# EAGLE schematic sirin-clone-schematic (EAGLE 9.3.1)
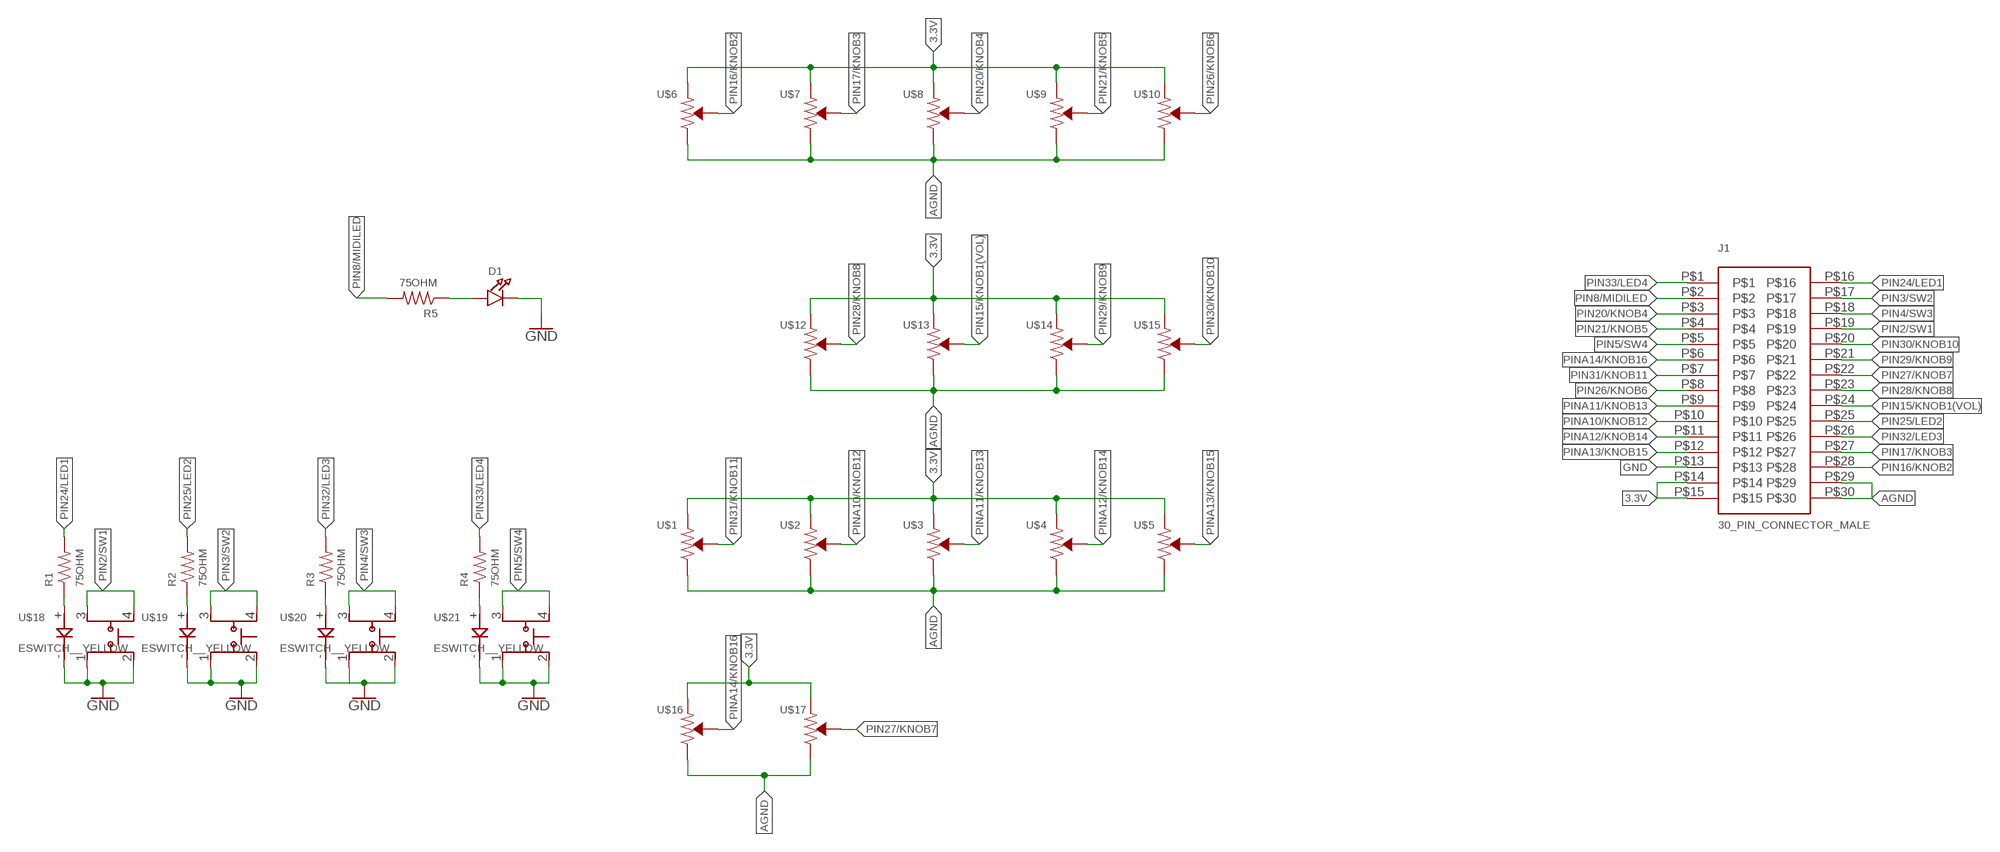
[diagram p0: schematic, sheet 1]

## Parts
D1  LED_RED0805  [CHIPLED_0805]
J1  30_PIN_CONNECTOR_MALE  [MOLEX_30PINCONNECTOR_2MM]
R1  75OHM  [0805]
R2  75OHM  [0805]
R3  75OHM  [0805]
R4  75OHM  [0805]
R5  75OHM  [0805]
U$1  BOURNS_10K_POTENTIOMETER  [BOURNS_PTV09]
U$2  BOURNS_10K_POTENTIOMETER  [BOURNS_PTV09]
U$3  BOURNS_10K_POTENTIOMETER  [BOURNS_PTV09]
U$4  BOURNS_10K_POTENTIOMETER  [BOURNS_PTV09]
U$5  BOURNS_10K_POTENTIOMETER  [BOURNS_PTV09]
U$6  BOURNS_10K_POTENTIOMETER  [BOURNS_PTV09]
U$7  BOURNS_10K_POTENTIOMETER  [BOURNS_PTV09]
U$8  BOURNS_10K_POTENTIOMETER  [BOURNS_PTV09]
U$9  BOURNS_10K_POTENTIOMETER  [BOURNS_PTV09]
U$10  BOURNS_10K_POTENTIOMETER  [BOURNS_PTV09]
U$12  BOURNS_10K_POTENTIOMETER  [BOURNS_PTV09]
U$13  BOURNS_10K_POTENTIOMETER  [BOURNS_PTV09]
U$14  BOURNS_10K_POTENTIOMETER  [BOURNS_PTV09]
U$15  BOURNS_10K_POTENTIOMETER  [BOURNS_PTV09]
U$16  BOURNS_10K_POTENTIOMETER  [BOURNS_PTV09]
U$17  BOURNS_10K_POTENTIOMETER  [BOURNS_PTV09]
U$18  ESWITCH__YELLOW  [ESWITCH_TL1240YQ1JCLR]
U$19  ESWITCH__YELLOW  [ESWITCH_TL1240YQ1JCLR]
U$20  ESWITCH__YELLOW  [ESWITCH_TL1240YQ1JCLR]
U$21  ESWITCH__YELLOW  [ESWITCH_TL1240YQ1JCLR]

## Nets
3.3V: J1.P$14 J1.P$15 U$1.1 U$2.1 U$3.1 U$4.1 U$5.1 U$6.1 U$7.1 U$8.1 U$9.1 U$10.1 U$12.1 U$13.1 U$14.1 U$15.1 U$16.1 U$17.1
AGND: J1.P$29 J1.P$30 U$1.3 U$2.3 U$3.3 U$4.3 U$5.3 U$6.3 U$7.3 U$8.3 U$9.3 U$10.3 U$12.3 U$13.3 U$14.3 U$15.3 U$16.3 U$17.3
GND: D1.C J1.P$13 U$18.1 U$18.2 U$18.- U$19.1 U$19.2 U$19.- U$20.1 U$20.2 U$20.- U$21.1 U$21.2 U$21.-
N$1: R1.1 U$18.+
N$2: R2.1 U$19.+
N$3: R3.1 U$20.+
N$4: R4.1 U$21.+
N$6: D1.A R5.1
PIN2/SW1: J1.P$19 U$18.3 U$18.4
PIN3/SW2: J1.P$17 U$19.3 U$19.4
PIN4/SW3: J1.P$18 U$20.3 U$20.4
PIN5/SW4: J1.P$5 U$21.3 U$21.4
PIN8/MIDILED: J1.P$2 R5.2
PIN15/KNOB1(VOL): J1.P$24 U$13.2
PIN16/KNOB2: J1.P$28 U$6.2
PIN17/KNOB3: J1.P$27 U$7.2
PIN20/KNOB4: J1.P$3 U$8.2
PIN21/KNOB5: J1.P$4 U$9.2
PIN24/LED1: J1.P$16 R1.2
PIN25/LED2: J1.P$25 R2.2
PIN26/KNOB6: J1.P$8 U$10.2
PIN27/KNOB7: J1.P$22 U$17.2
PIN28/KNOB8: J1.P$23 U$12.2
PIN29/KNOB9: J1.P$21 U$14.2
PIN30/KNOB10: J1.P$20 U$15.2
PIN31/KNOB11: J1.P$7 U$1.2
PIN32/LED3: J1.P$26 R3.2
PIN33/LED4: J1.P$1 R4.2
PINA10/KNOB12: J1.P$10 U$2.2
PINA11/KNOB13: J1.P$9 U$3.2
PINA12/KNOB14: J1.P$11 U$4.2
PINA13/KNOB15: J1.P$12 U$5.2
PINA14/KNOB16: J1.P$6 U$16.2

## Library data of the parts
D1 = sirin-clone-library:LED_RED: LED 0603 - 0603 Surface Mount Package 2mA: Green LED - Low Power (3.9mcd, 2ma, 1.7Vf) - Digikey: 475-2709-2-ND Orange LED - Low Power (9.8mcd, 2ma, 1.8Vf) - Digikey: 475-1194-2-ND Red LED - Low Power (5mcd, 2ma, 1.8Vf) - Digikey: 475-1195-2-ND Yellow LED - Low Power (7mcd, 2ma, 1.8Vf) - Digikey: 475-1196-2-ND 5mA: Blue LED - Low Power (17mcd, 5ma, 2.9Vf) - Digikey: LNJ937W8CRACT-ND 0805 - 0805 Surface Mount Package 2mA: Red LED (8.8mcd, 2mA, 1.8Vf, Clear) - Low Power [Digikey: 475-2510-1-ND] Green LED (5mcd, 2mA, 1.8Vf, Clear) - Low Power [Digikey: 475-2730-1-ND] Yellow LED (11.3mcd, 2mA, 1.8Vf, Clear) - Low Power [Digikey: 475-2555-1-ND] 20mA: Red LED (104mcd, 20mA, Diffused) - LS R976 [Digikey: 475-1278-6-ND] Red LED (12mcd, 20mA, 2.0Vf, Clear) - APT2012EC [Digikey: 754-1128-1-ND] Green LED (15mcd, 20mA, 2.2Vf, Clear) - APT2012GC [Digikey: 754-1131-1-ND] Orange LED (160mcd, 20mA, 2.1Vf, Clear) - APT2012SECK [Digikey: 754-1130-1-ND] 1206 - 1206 Surface Mount Package Green LED (26mcd, 20mA, Diffused) - LG N971 [Digikey: 475-1407-6-ND] Red LED (15mcd, 20mA, Diffused) - LH N974 [Digikey: 475-1416-6-ND] Cree - Cree High-Power Surface Mount LEDs XPEBWT-L1-0000-00D50 - White 111lm 350mA 2.9Vf 6200K 110° XTEAWT-00-0000-00000LEE3 - White 114lm 350mA 2.85Vf 5000K 115° Everlight - Everlight 45-21 Series Surface Mount LEDs 45-21/QK2C-B2832AC2CB2/2T - Warm White 2000mcd 20mA 3.25Vf 3050K 120° 45-21/LK2C-B38452C4CB2/2T - Nuetral White 2000mcd 20mA 3.25Vf 4150K 120° 45-21/LK2C-B50634C6CB2/2T - Cold White 2200mcd 20mA 3.25Vf 5650K 120° PLCC2 Reverse Mount LS T77K-J1L2-1-0-2-R18-Z - Red 11.25mcd 2mA 1.8Vf 630nm 120° LO T77K-L1M2-24-Z - Orange 19.6mcd 2mA 1.8Vf 606nm 120° LY T77K-K2M1-26-Z - Yellow 15.7mcd 2mA 1.8Vf 587nm 120°; DPN: 732-4978-1-ND; LINK: https://www.digikey.com/product-detail/en/wurth-electronics-inc/150060RS75000/732-4978-1-ND/4489899; MPN: 150060RS75000
J1 = sirin-clone-library:30_PIN_CONNECTOR_MALE; SPICEPREFIX: X
R1-R5 = sirin-clone-library:75OHM; DPN: RNCP0805FTD75R0CT-ND; LINK: https://www.digikey.com/product-detail/en/stackpole-electronics-inc/RNCP0805FTD75R0/RNCP0805FTD75R0CT-ND/2240546; MPN: RNCP0805FTD75R0
U$1-U$10 U$12-U$17 = sirin-clone-library:BOURNS_10K_POTENTIOMETER: https://www.digikey.com/product-detail/en/bourns-inc/PTV09A-4020F-B103/PTV09A-4020F-B103-ND/3534181; DPN: PTV09A-4020F-B103-ND; LINK: https://www.digikey.com/product-detail/en/bourns-inc/PTV09A-4020F-B103/PTV09A-4020F-B103-ND/3534181; MPN: PTV09A-4020F-B103
U$18-U$21 = sirin-clone-library:ESWITCH__YELLOW: https://www.digikey.com/product-detail/en/e-switch/TL1240YQ1JCLR/EG4616-ND/1805485; DPN: EG4616-ND; LINK: https://www.digikey.com/product-detail/en/e-switch/TL1240YQ1JCLR/EG4616-ND/1805485; MPN: TL1240YQ1JCLR